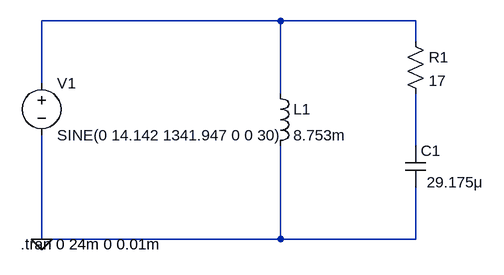
[diagram p0: schematic Lab3_2_9.asc]
Lab3_2_9.asc, the LTspice schematic file:
Version 4
SHEET 1 880 680
WIRE 448 16 80 16
WIRE 656 16 448 16
WIRE 656 48 656 16
WIRE 80 112 80 16
WIRE 448 128 448 16
WIRE 656 208 656 128
WIRE 80 352 80 192
WIRE 448 352 448 208
WIRE 448 352 80 352
WIRE 656 352 656 272
WIRE 656 352 448 352
FLAG 80 352 0
SYMBOL voltage 80 96 R0
WINDOW 123 0 0 Left 0
WINDOW 39 0 0 Left 0
SYMATTR InstName V1
SYMATTR Value SINE(0 14.142 1341.947 0 0 30)
SYMBOL res 640 32 R0
SYMATTR InstName R1
SYMATTR Value 17
SYMBOL cap 640 208 R0
WINDOW 3 33 56 Left 2
SYMATTR Value 29.175μ
SYMATTR InstName C1
SYMBOL ind 432 112 R0
SYMATTR InstName L1
SYMATTR Value 8.753m
SYMATTR SpiceLine Rser=10
TEXT 48 360 Left 2 !.tran 0 24m 0 0.01m

The netlist it stands for:
* Lab3_2_9.asc
V1 N001 0 SINE(0 14.142 1341.947 0 0 30)
R1 N001 N002 17
C1 N002 0 29.175μ
L1 N001 0 8.753m Rser=10
.tran 0 24m 0 0.01m
.backanno
.end